# Altium schematic sheet Main.SchDoc
size A4; SheetNumber: 1; SheetTotal: 7
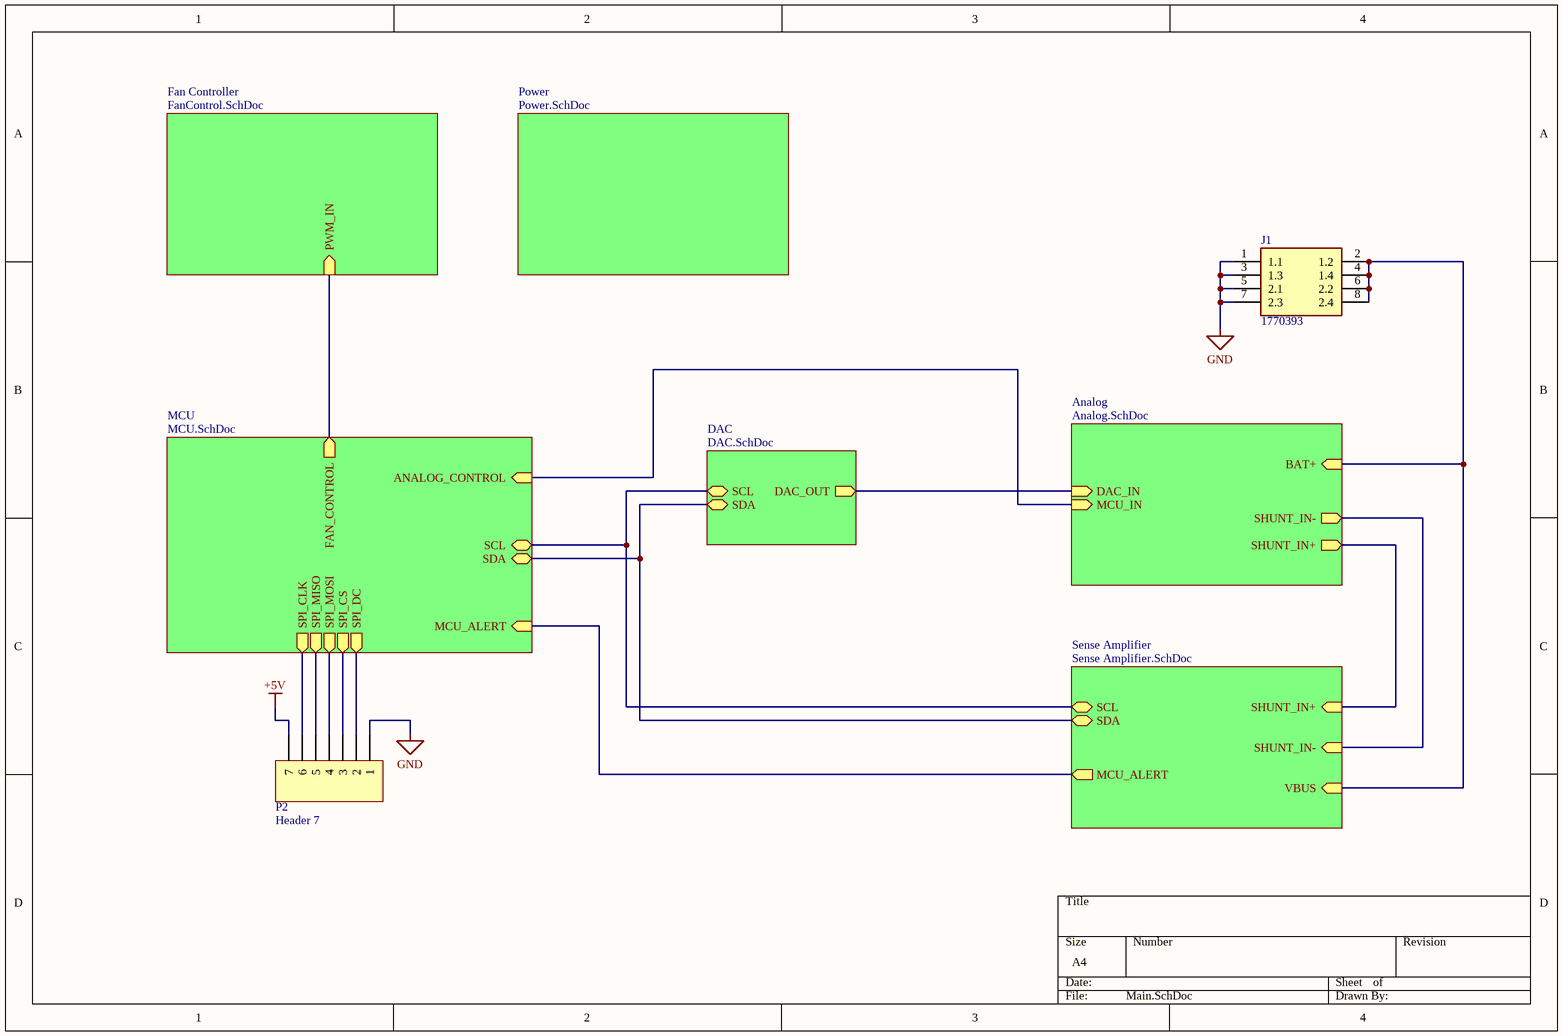
[diagram p0: Main.SchDoc]

## Parts
J1  1770393  [1770393]
P2  Header 7  [HDR1X7]

## Sub-sheets
Analog = Analog.SchDoc: DAC_IN (in), BAT+ (in), MCU_IN (in), SHUNT_IN+ (out), SHUNT_IN- (out)
DAC = DAC.SchDoc: DAC_OUT (out), SCL (bidir), SDA (bidir)
Fan Controller = FanControl.SchDoc: PWM_IN (in)
MCU = MCU.SchDoc: SPI_CLK (out), SPI_MISO (out), SPI_MOSI (out), SPI_CS (out), SPI_DC (out), FAN_CONTROL (out), SCL (bidir), SDA (bidir), MCU_ALERT (in), ANALOG_CONTROL (in)
Power = Power.SchDoc: no entries
Sense Amplifier = Sense Amplifier.SchDoc: SHUNT_IN+ (in), SHUNT_IN- (in), SCL (bidir), SDA (bidir), MCU_ALERT (out), VBUS (in)

## Nets
+5V: P2.7
GND: J1.1(1.1) J1.3(1.3) J1.5(2.1) J1.7(2.3) P2.1
NetJ1_2: J1.2(1.2) J1.4(1.4) J1.6(2.2) J1.8(2.4) ; sheet Analog/BAT+, sheet Sense Amplifier/VBUS
NetP2_2: P2.2 ; sheet MCU/SPI_DC
NetP2_3: P2.3 ; sheet MCU/SPI_CS
NetP2_4: P2.4 ; sheet MCU/SPI_MOSI
NetP2_5: P2.5 ; sheet MCU/SPI_MISO
NetP2_6: P2.6 ; sheet MCU/SPI_CLK
(unnamed): sheet Analog/DAC_IN, sheet DAC/DAC_OUT
(unnamed): sheet Analog/MCU_IN, sheet MCU/ANALOG_CONTROL
(unnamed): sheet Analog/SHUNT_IN+, sheet Sense Amplifier/SHUNT_IN+
(unnamed): sheet Analog/SHUNT_IN-, sheet Sense Amplifier/SHUNT_IN-
(unnamed): sheet MCU/FAN_CONTROL, sheet Fan Controller/PWM_IN
(unnamed): sheet MCU/SCL, sheet DAC/SCL, sheet Sense Amplifier/SCL
(unnamed): sheet MCU/SDA, sheet DAC/SDA, sheet Sense Amplifier/SDA
(unnamed): sheet MCU/MCU_ALERT, sheet Sense Amplifier/MCU_ALERT

## Library data of the parts
J1 = 1770393: Connector; Manufacturer_Name: Phoenix Contact; Datasheet Link: https://www.phoenixcontact.com/online/portal/us/pxc/product_detail_page/!ut/p/z1/3Vdbb9owFP4r9IFHYzsXJ5m0B6BoQCkLJawkL1HsGOQ1tyYBOn79HC7dQBs8VGhaoiPFds75zsX-rBzowTn0kmAtlkEp0iSI5Nz1iO90nF7PVgj-OtE7aHCvd3sj7Qn3xwr8Bj3olQGFLq5GkaB5kP-A7qrgSbWQiVB-MgykWmo1Tx; Height: 29.2mm; Manufacturer_Part_Number: 1770393; Mouser Part Number: 651-1770393; Mouser Price/Stock: https://www.mouser.co.uk/ProductDetail/Phoenix-Contact/1770393?qs=MfVUZiz0PxY16TK7qzndTA%3D%3D; Arrow Part Number: 1770393; Arrow Price/Stock: https://www.arrow.com/en/products/1770393/phoenix-contact
P2 = Header 7: Header, 7-Pin; LatestRevisionDate: 17-Jul-2002; LatestRevisionNote: Re-released for DXP Platform.; Publisher: Altium Limited